# EAGLE design MouseMA (EAGLE 9.6.2)
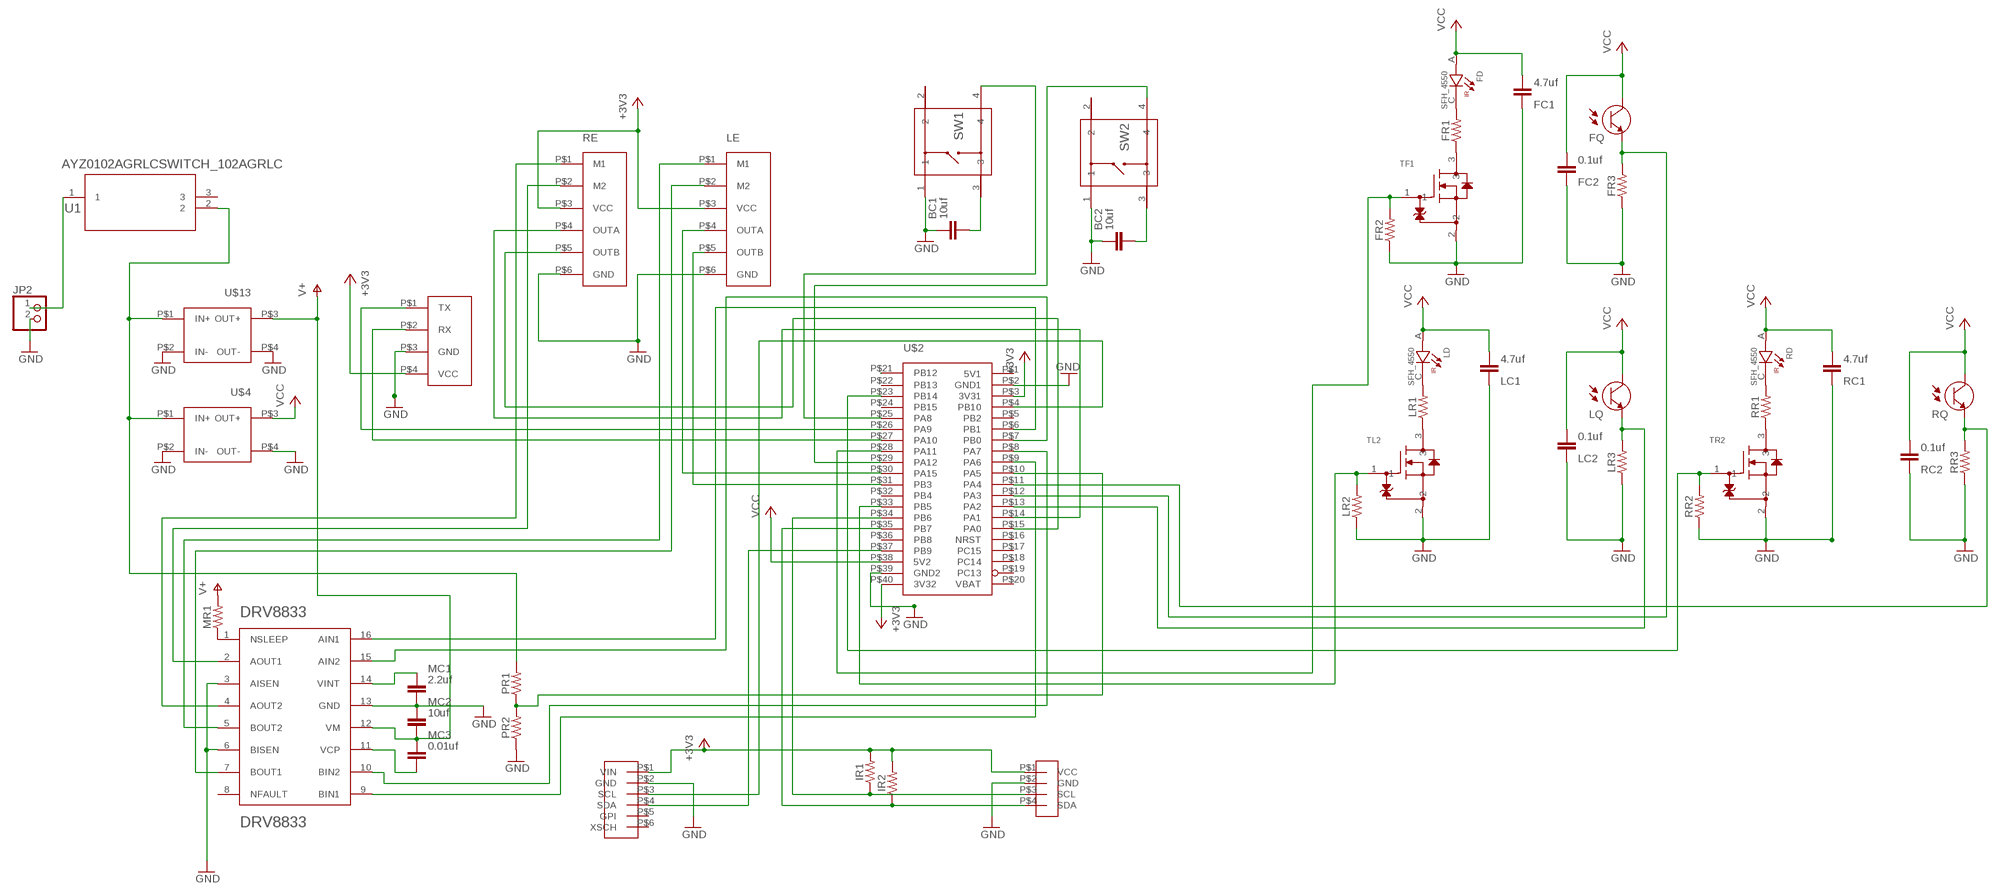
[diagram p0: schematic, sheet 1]

## Parts
BC1  10uf  CAPACITOR_NPOL-0805  [C805]
BC2  10uf  CAPACITOR_NPOL-0805  [C805]
DRV8833PWP1  DRV8833  [SOP65P640X120-17N]
FC1  4.7uf  CAPACITOR_NPOL-0805  [C805]
FC2  0.1uf  CAPACITOR_NPOL-0805  [C805]
FD  SFH_4550  [DIO_SFH_4550]
FQ  TEFT4300  [XDCR_TEFT4300]
FR1  RESISTOR0805  [0805]
FR2  RESISTOR0805  [0805]
FR3  RESISTOR0805  [0805]
IR1  2.0k  RESISTOR0805  [0805]
IR2  2.0k  RESISTOR0805  [0805]
JP2  PINHD-1X2  [1X02]
LC1  4.7uf  CAPACITOR_NPOL-0805  [C805]
LC2  0.1uf  CAPACITOR_NPOL-0805  [C805]
LD  SFH_4550  [DIO_SFH_4550]
LE  ENCODER  [6PINS]
LQ  TEFT4300  [XDCR_TEFT4300]
LR1  RESISTOR0805  [0805]
LR2  RESISTOR0805  [0805]
LR3  RESISTOR0805  [0805]
MC1  2.2uf  CAPACITOR_NPOL-0805  [C805]
MC2  10uf  CAPACITOR_NPOL-0805  [C805]
MC3  0.01uf  CAPACITOR_NPOL-0805  [C805]
MR1  RESISTOR0805  [0805]
PR1  18K  RESISTOR0805  [0805]
PR2  10k  RESISTOR0805  [0805]
RC1  4.7uf  CAPACITOR_NPOL-0805  [C805]
RC2  0.1uf  CAPACITOR_NPOL-0805  [C805]
RD  SFH_4550  [DIO_SFH_4550]
RE  ENCODER  [6PINS]
RQ  TEFT4300  [XDCR_TEFT4300]
RR1  RESISTOR0805  [0805]
RR2  RESISTOR0805  [0805]
RR3  RESISTOR0805  [0805]
SW1  PTS815_SJM_250_SMTR_LFSSW4_PTS815_SJM_250_SMTR_LFS_CN  [SW4_PTS815_SJM_250_SMTR_LFS_CN]
SW2  PTS815_SJM_250_SMTR_LFSSW4_PTS815_SJM_250_SMTR_LFS_CN  [SW4_PTS815_SJM_250_SMTR_LFS_CN]
TF1  SSM3K324R,LFSOT-23F_TOS  [SOT-23F_TOS]
TL2  SSM3K324R,LFSOT-23F_TOS  [SOT-23F_TOS]
TR2  SSM3K324R,LFSOT-23F_TOS  [SOT-23F_TOS]
U1  AYZ0102AGRLCSWITCH_102AGRLC  [SWITCH_102AGRLC]
U$1  LADAR6DEV  [6PINS]
U$2  STM32F4BOARD  [STM32BOARD]
U$3  OLEDVCC  [OLEPINS]
U$4  POWER1  [PWR1PINS]
U$13  POWER1  [PWR1PINS]
UARTXRX  UART2  [4PINS]

## Nets
+3V3: IR1.2 IR2.2 LE.P$3(VCC) RE.P$3(VCC) U$1.P$1(VIN) U$2.P$3(3V31) U$2.P$40(3V32) U$3.P$1(VCC) UARTXRX.P$4(VCC)
GND: BC1.1 BC2.1 DRV8833PWP1.3(AISEN) DRV8833PWP1.6(BISEN) DRV8833PWP1.13(GND) FC1.2 FC2.2 FR2.1 FR3.1 JP2.2 LC1.2 LC2.2 LE.P$6(GND) LR2.1 LR3.1 MC1.2 MC2.1 PR2.1 RC1.2 RC2.2 RE.P$6(GND) RR2.1 RR3.1 SW1.1 SW2.1 TF1.2 TL2.2 TR2.2 U$1.P$2(GND) U$2.P$2(GND1) U$2.P$39(GND2) U$3.P$2(GND) U$4.P$2(IN-) U$4.P$4(OUT-) U$13.P$2(IN-) U$13.P$4(OUT-) UARTXRX.P$3(GND)
N$1: LR2.2 TL2.1 U$2.P$33(PB5)
N$2: JP2.1 U1.1
N$3: BC2.2 SW2.3
N$4: PR1.1 PR2.2 U$2.P$10(PA5)
N$5: U$2.P$21(PB12)
N$6: U$2.P$26(PA9) UARTXRX.P$1(TX)
N$7: U$1.P$3(SCL) U$2.P$4(PB10)
N$8: DRV8833PWP1.10(BIN2) U$2.P$8(PA7)
N$9: U$1.P$4(SDA) U$2.P$37(PB9)
N$10: FR1.1 TF1.3
N$11: LR1.1 TL2.3
N$12: RR1.1 TR2.3
N$13: FR2.2 TF1.1 U$2.P$28(PA11)
N$14: IR2.1 U$2.P$35(PB7) U$3.P$4(SDA)
N$15: BC1.2 SW1.3
N$17: IR1.1 U$2.P$34(PB6) U$3.P$3(SCL)
N$18: RE.P$5(OUTB) U$2.P$15(PA0)
N$19: RE.P$4(OUTA) U$2.P$14(PA1)
N$21: FD.C FR1.2
N$22: DRV8833PWP1.2(AOUT1) RE.P$2(M2)
N$23: U$2.P$27(PA10) UARTXRX.P$2(RX)
N$24: DRV8833PWP1.4(AOUT2) RE.P$1(M1)
N$25: PR1.2 U1.2 U$4.P$1(IN+) U$13.P$1(IN+)
N$26: DRV8833PWP1.9(BIN1) U$2.P$9(PA6)
N$27: DRV8833PWP1.16(AIN1) U$2.P$6(PB1)
N$29: DRV8833PWP1.7(BOUT1) LE.P$2(M2)
N$30: DRV8833PWP1.5(BOUT2) LE.P$1(M1)
N$31: LE.P$5(OUTB) U$2.P$31(PB3)
N$32: LE.P$4(OUTA) U$2.P$30(PA15)
N$33: DRV8833PWP1.1(NSLEEP) MR1.1
N$34: SW2.4 U$2.P$29(PA12)
N$36: DRV8833PWP1.14(VINT) MC1.1
N$38: DRV8833PWP1.11(VCP) MC3.2
N$45: DRV8833PWP1.15(AIN2) U$2.P$7(PB0)
N$46: FQ.E FR3.2 U$2.P$12(PA3)
N$50: RQ.E RR3.2 U$2.P$11(PA4)
N$52: LQ.E LR3.2 U$2.P$13(PA2)
N$53: SW1.4 U$2.P$25(PA8)
N$54: LD.C LR1.2
N$62: RD.C RR1.2
N$63: RR2.2 TR2.1 U$2.P$23(PB14)
V+: DRV8833PWP1.12(VM) MC2.2 MC3.1 MR1.2 U$13.P$3(OUT+)
VCC: FC1.1 FC2.1 FD.A FQ.C LC1.1 LC2.1 LD.A LQ.C RC1.1 RC2.1 RD.A RQ.C U$2.P$38(5V2) U$4.P$3(OUT+)
Unconnected: DRV8833PWP1.8(NFAULT) SW1.2 SW2.2 U1.3 U$1.P$5(GPI) U$1.P$6(XSCH) U$2.P$5(PB2) U$2.P$16(NRST) U$2.P$17(PC15) U$2.P$18(PC14) U$2.P$19(PC13) U$2.P$22(PB13) U$2.P$24(PB15) U$2.P$32(PB4) U$2.P$36(PB8)

## Power pins joined to a net without a drawn wire
5V1: U$2.P$1(5V1)
VBAT: U$2.P$20(VBAT)

## Library data of the parts
BC1 BC2 FC1 FC2 LC1 LC2 MC1-MC3 RC1 RC2 = dp_devices:CAPACITOR_NPOL: Non-Polarized capacitor in various packages
DRV8833PWP1 = DRV8833PWP:DRV8833
FD LD RD = SFH_4550:SFH_4550: Infrared Emitter (850 nm) Check prices <https://pricing.snapeda.com/parts/SFH%204550/OSRAM%20Opto/view-part?ref=eda>
FQ LQ RQ = TEFT4300:TEFT4300; DESCRIPTION: Phototransistors 925nm Top View Radial, 3mm Dia (T-1); DIGI-KEY_PART_NUMBER: 751-1041-ND; MF: Vishay Semiconductor; MP: TEFT4300; PACKAGE: Radial Vishay; PURCHASE-URL: https://pricing.snapeda.com/search/part/TEFT4300/?ref=eda
FR1-FR3 IR1 IR2 LR1-LR3 MR1 PR1 PR2 RR1-RR3 = SparkFun-Resistors:RESISTOR: Generic Resistor Package
JP2 = pinhead:PINHD-1X2: PIN HEADER
LE RE = MouseLib:ENCODER
SW1 SW2 = 2024-03-03_00-07-10_Library:PTS815_SJM_250_SMTR_LFS; COPYRIGHT: Copyright (C) 2024 Ultra Librarian. All rights reserved.; MANUFACTURER_PART_NUMBER: PTS815 SJM 250 SMTR LFS; MFR_NAME: C&K Components
TF1 TL2 TR2 = 2024-11-24_22-53-16_Library:SSM3K324R,LF; COPYRIGHT: Copyright (C) 2024 Ultra Librarian. All rights reserved.; MANUFACTURER_PART_NUMBER: SSM3K324R,LF; MFR_NAME: Toshiba Electronic Devices & Storage Corp.
U1 = 2024-03-03_00-04-04_Library:AYZ0102AGRLC; COPYRIGHT: Copyright (C) 2024 Ultra Librarian. All rights reserved.; MANUFACTURER_PART_NUMBER: AYZ0102AGRLC; MFR_NAME: C&K Components
U$1 = MouseLib:LADAR6DEV
U$2 = MouseLib:STM32F4BOARD
U$3 = MouseLib:OLEDVCC
U$4 U$13 = MouseLib:POWER1
UARTXRX = MouseLib:UART2

## Board
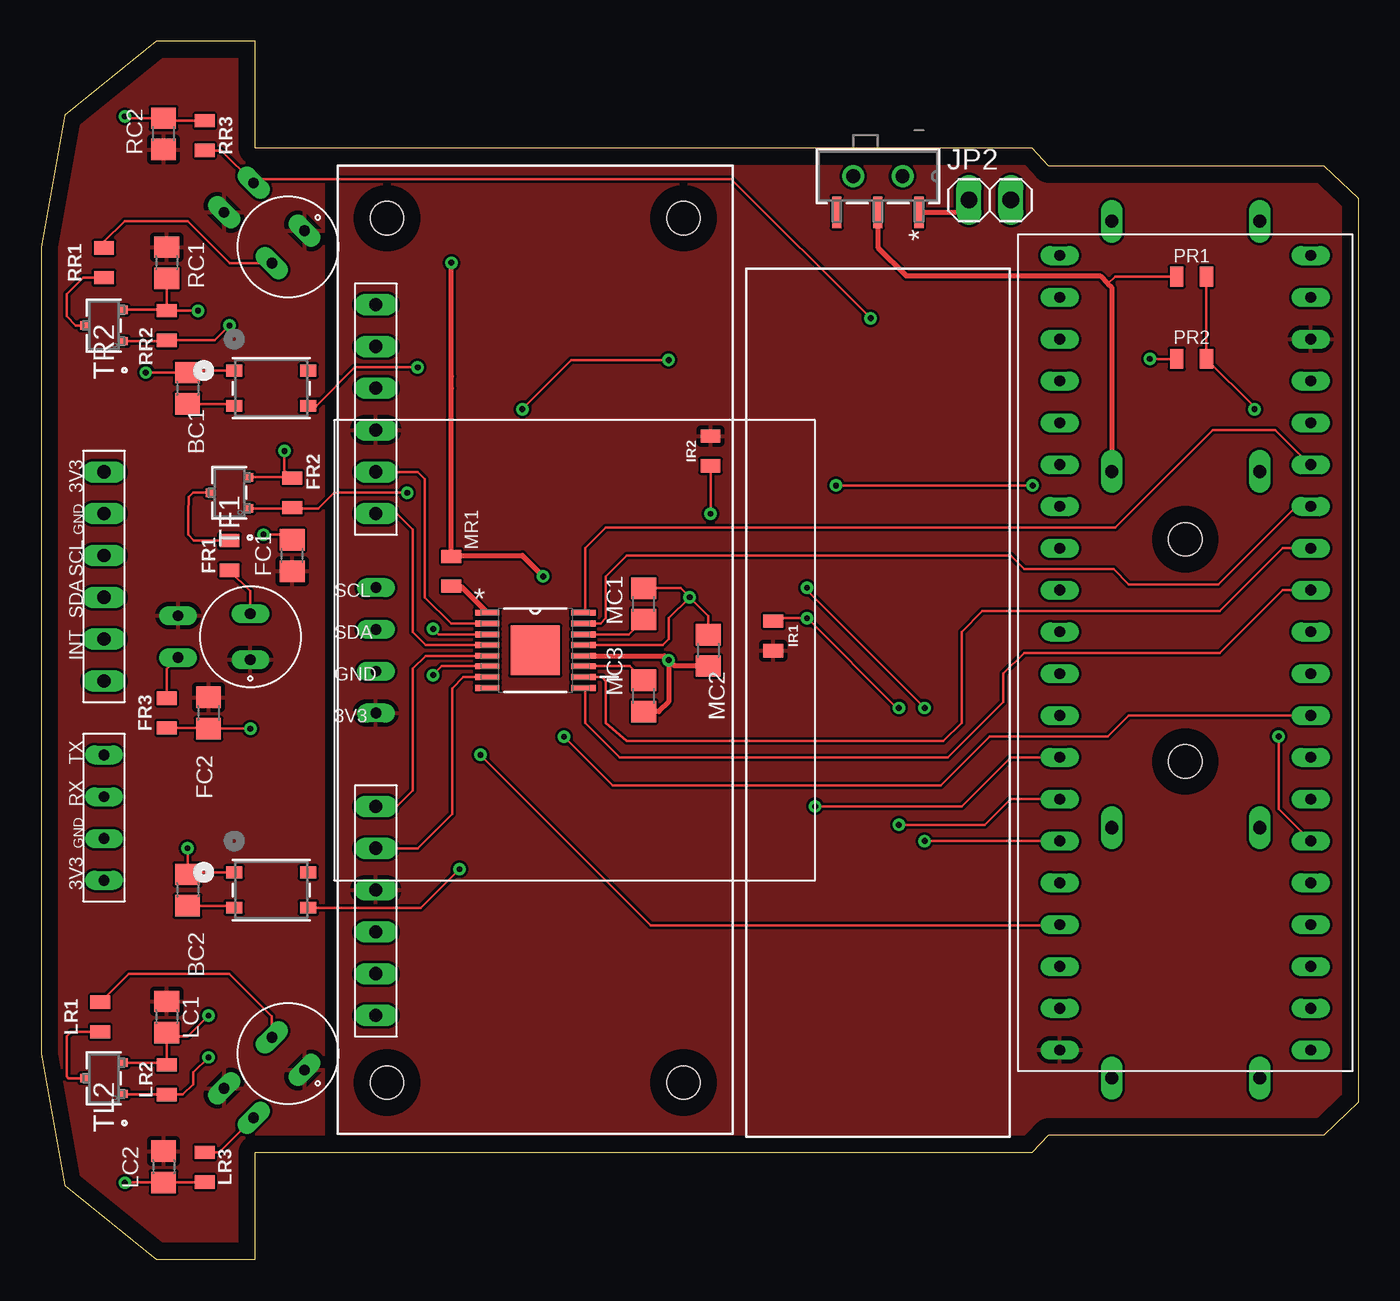
[diagram p1: board, top side]
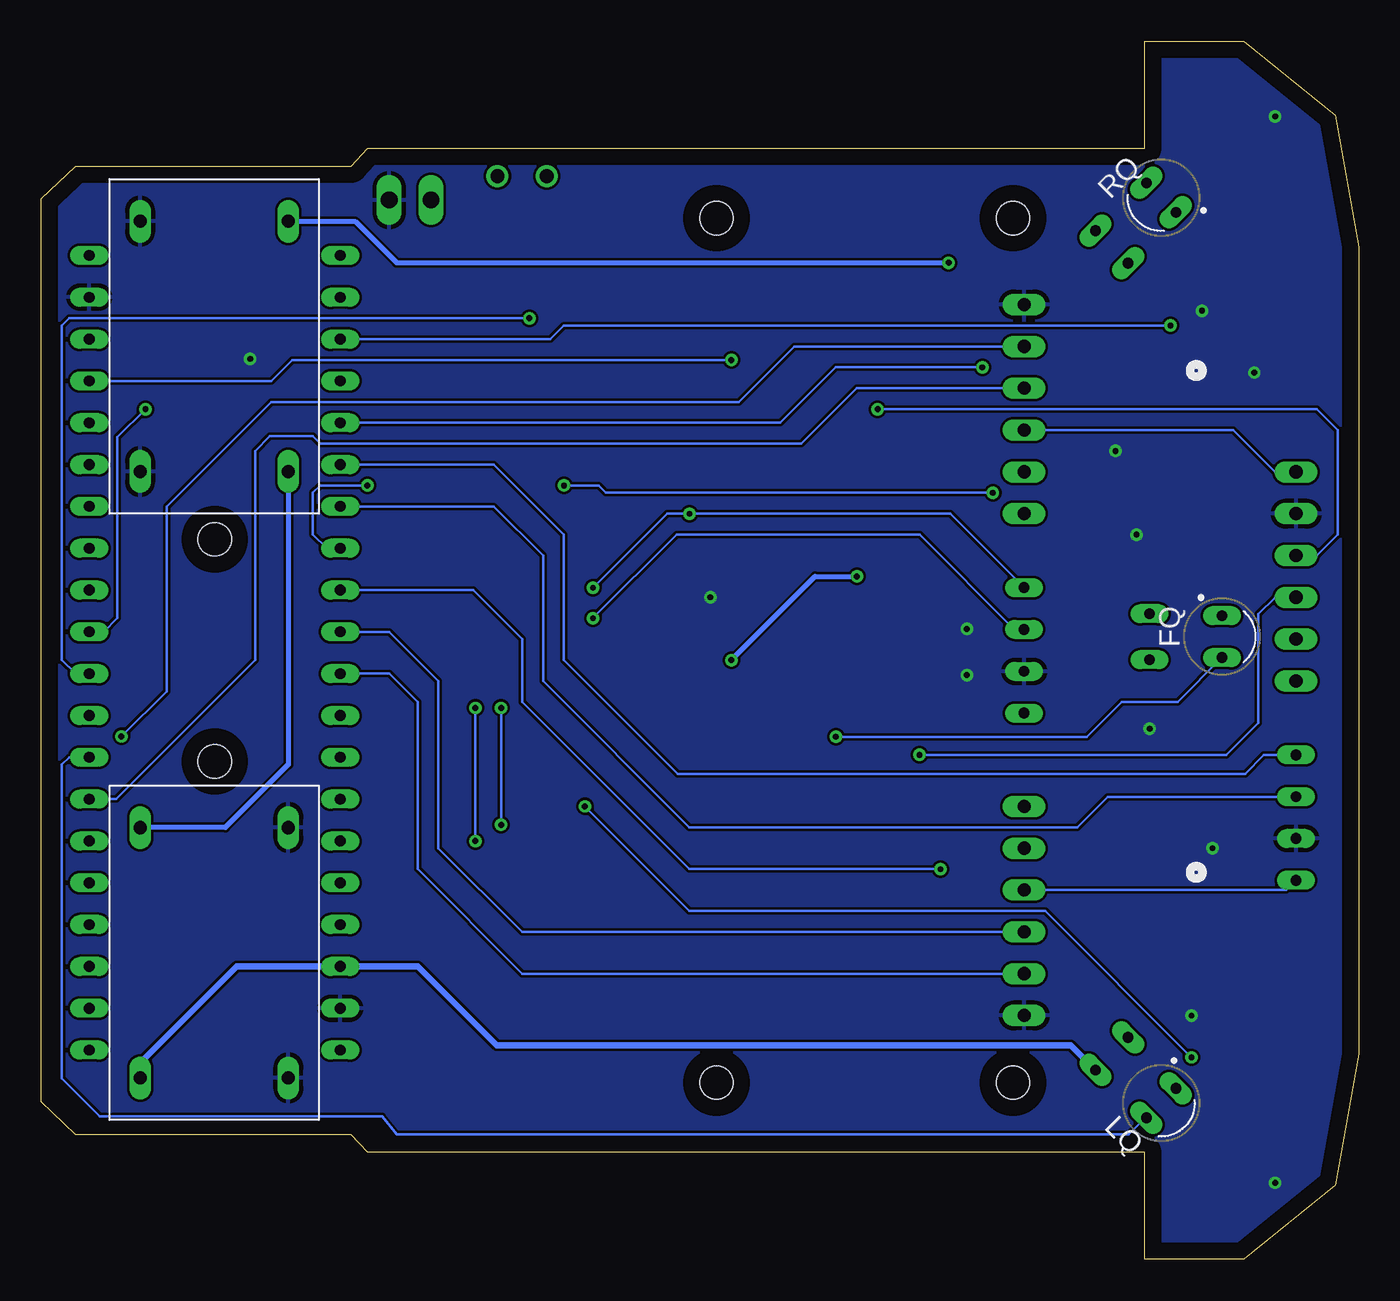
[diagram p2: board, bottom side, seen from below]

Size 80 x 74 mm. Coordinates in mm from the lower left corner, seen from the top.
Outline: 1.42,4.5 7,0 13,0 13,6.5 60.16,6.5 61.16,7.58 77.89,7.58 80,9.58 80,64.42 77.89,66.42 61.16,66.42 60.16,67.5 13,67.5 13,74 7,74 1.42,69.5 0,61.5 0,12.5 1.42,4.5
Copper layers (1*16): Top 0.035mm / dielectric 1.5mm / Bottom 0.035mm
Design rules "default": minimum track width 6mil, minimum drill 0.35mm, track to track 6mil, track to pad 6mil, pad to pad 6mil, via to via 6mil, smd to smd 6mil, copper to edge 40mil, drill to drill 6mil, minimum pad ring 10mil, minimum via ring 8mil, stop-mask expansion 4mil, vias tented up to drill 0mil, thermal gap 10mil
Holes 2 mm at 69.46,43.75 69.46,30.25 39,63.25 21,63.25 21,10.75 39,10.75

### Footprints (pad centres in the part's own frame; a part is rotated, then mirrored left to right if it is on the bottom)
C805 = smd 1.3 x 1.5: 1 -0.95,0; 2 0.95,0
SOP65P640X120-17N = smd 1.473 x 0.356: 1 -2.921,2.286; 2 -2.921,1.626; 3 -2.921,0.965; 4 -2.921,0.33; 5 -2.921,-0.33; 6 -2.921,-0.965; 7 -2.921,-1.626; 8 -2.921,-2.286; 9 2.921,-2.286; 10 2.921,-1.626; 11 2.921,-0.965; 12 2.921,-0.33; 13 2.921,0.33; 14 2.921,0.965; 15 2.921,1.626; 16 2.921,2.286 | smd 2.997 x 2.997: 17 0,0
DIO_SFH_4550 = drill 0.65 long: A 1.397,0; C -1.397,0
XDCR_TEFT4300 = drill 0.65 long: C 1.27,0; E -1.27,0
0805 = smd 0.8 x 1.2: 1 -0.9,0; 2 0.9,0
1X02 = drill 1.016 long: 1 -1.27,0; 2 1.27,0
6PINS = drill 0.8 pad 1.143 long: P$1 -2.54,10.16; P$2 -2.54,7.62; P$3 -2.54,5.08; P$4 -2.54,2.54; P$5 -2.54,0; P$6 -2.54,-2.54
SW4_PTS815_SJM_250_SMTR_LFS_CN = smd 0.991 x 0.711: 1 -2.25,1.075; 2 2.25,1.075; 3 -2.25,-1.075; 4 2.25,-1.075
SOT-23F_TOS = smd 0.508 x 0.508: 1 -0.95,-1.194; 2 0.95,-1.194; 3 0,1.194
SWITCH_102AGRLC = smd 1.905 x 0.559: 1 2.197,2.5; 2 2.197,0; 3 2.197,-2.5 | drill 0.838 pad 1.346: 4 0,-1.5; 5 0,1.5
STM32BOARD = drill 0.65 long: P$1 8.89,30.48; P$2 8.89,27.94; P$3 8.89,25.4; P$4 8.89,22.86; P$5 8.89,20.32; P$6 8.89,17.78; P$7 8.89,15.24; P$8 8.89,12.7; P$9 8.89,10.16; P$10 8.89,7.62; P$11 8.89,5.08; P$12 8.89,2.54; P$13 8.89,0; P$14 8.89,-2.54; P$15 8.89,-5.08; P$16 8.89,-7.62; P$17 8.89,-10.16; P$18 8.89,-12.7; P$19 8.89,-15.24; P$20 8.89,-17.78; P$21 -6.35,30.48; P$22 -6.35,27.94; P$23 -6.35,25.4; P$24 -6.35,22.86; P$25 -6.35,20.32; P$26 -6.35,17.78; P$27 -6.35,15.24; P$28 -6.35,12.7; P$29 -6.35,10.16; P$30 -6.35,7.62; P$31 -6.35,5.08; P$32 -6.35,2.54; P$33 -6.35,0; P$34 -6.35,-2.54; P$35 -6.35,-5.08; P$36 -6.35,-7.62; P$37 -6.35,-10.16; P$38 -6.35,-12.7; P$39 -6.35,-15.24; P$40 -6.35,-17.78
OLEPINS = drill 0.65 long: P$1 -3.81,12.7; P$2 -1.27,12.7; P$3 1.27,12.7; P$4 3.81,12.7
PWR1PINS = drill 0.8 pad 1.143 long: P$1 7.6,4.5; P$2 7.6,-4.5; P$3 -7.6,4.5; P$4 -7.6,-4.5
4PINS = drill 0.65 long: P$1 0,3.81; P$2 0,1.27; P$3 0,-1.27; P$4 0,-3.81

### Placement (x,y rotation side)
BC1  8.89,52.92 270 top
BC2  8.89,22.44 270 top
DRV8833PWP1  30,37 0 top
FC1  15.24,42.76 90 top
FC2  10.16,33.19 270 top
FD  12.7,37.83 270 top
FQ  8.31,37.83 90 bottom
FR1  11.43,42.76 270 top
FR2  15.24,46.57 270 top
FR3  7.62,33.19 90 top
IR1  44.45,37.88 270 top
IR2  40.64,49.11 90 top
JP2  57.6,64.35 0 top
LC1  7.62,14.73 270 top
LC2  7.43,5.63 270 top
LD  15,12.5 315 top
LE  22.86,17.36 0 top
LQ  12,9.5 45 bottom
LR1  3.59,14.73 90 top
LR2  7.62,10.92 270 top
LR3  9.93,5.61 90 top
MC1  36.58,39.82 90 top
MC2  40.5,37 270 top
MC3  36.58,34.23 90 top
MR1  24.9,41.8 90 top
PR1  69.85,59.7 180 top
PR2  69.85,54.7 0 top
RC1  7.62,60.54 270 top
RC2  7.43,68.37 90 top
RD  15,61.5 45 top
RE  17.78,55.46 180 top
RQ  12,64.5 315 bottom
RR1  3.81,60.54 90 top
RR2  7.62,56.73 270 top
RR3  9.93,68.26 270 top
SW1  13.97,52.92 0 top
SW2  13.97,22.44 0 top
TF1  11.43,46.57 90 top
TL2  3.81,11.01 90 top
TR2  3.81,56.73 90 top
U1  50.8,65.8 270 top
U$1  6.35,37.68 0 top
U$2  68.19,30.5 0 top
U$3  33.02,37 90 top
U$4  69.49,18.63 90 bottom
U$13  69.49,55.46 270 bottom
UARTXRX  3.81,26.84 0 top

### Tracks (layer width: path | path; a pad name or v marks a point on that pad's centre or on a via)
+3V3
  Bottom 0.152: U$1.P$1 5.08,47.84 7.62,50.38 RE.P$3 | UARTXRX.P$4 4.4,22.44 LE.P$3
  pour Top: 18.2,73.24 18.2,0.85 86.36,0.85 86.36,73.24
GND  (via drill 0.35)
  Top 0.152: RR2.1 RC1.2 | v5.08,69.43 5.19,69.32 RC2.2 7.59,69.16 RR3.1 | v6.35,53.87 BC1.1 9.02,53.99 SW1.1 | FR3.1 10.11,32.29 FC2.2 v12.7,32.24 | v8.89,24.98 BC2.1 9.02,23.52 SW2.1 | LR3.1 9.9,4.68 LC2.2 5.1,4.68 v5.08,4.66 | v67.31,54.7 PR2.1 | MC1.2 38.82,40.77 v39.37,40.22 | v10.16,14.82 8.89,13.55 7.85,13.55 LC1.2 LR2.1 7.37,11.57 6.98,11.96 TL2.2 | DRV8833PWP1.13 37.75,37.33 38.1,37.68 38.1,38.95 v39.37,40.22 | DRV8833PWP1.3 24.14,37.97 v23.8,38.3 | v23.8,35.5 24.34,36.03 DRV8833PWP1.6 | v39.37,40.22 40.5,39.09 MC2.1 | FC1.2 14.92,44.03 v13.5,44.03 | TR2.2 7.57,57.68 RR2.1 | TF1.2 15.19,47.52 FR2.1 14.77,47.94 v14.77,49.11 | RR2.1 v9.53,57.63
  pour Bottom: -7.62,68.16 -7.62,0.85 3.81,-10.58 88.9,-10.58 88.9,82.13 6.35,82.13
N$1  (via drill 0.35)
  Top 0.152: TL2.1 5.04,10.02 LR2.2 8.61,10.02 9.24,10.66 9.24,11.36 v10.16,12.28 | v46.99,27.52 55.88,27.52 58.86,30.5 U$2.P$33
  Bottom 0.152: v10.16,12.28 19.05,21.17 40.64,21.17 v46.99,27.52
N$2
  Top 0.305: U1.1 56.4,63.6 JP2.1
N$3
  Top 0.152: BC2.2 11.6,21.49 SW2.3
N$4  (via drill 0.35)
  Top 0.152: v73.66,51.65 73.66,51.79 PR2.2 PR1.1
  Bottom 0.152: v73.66,51.65 75.37,49.94 75.37,38.95 76.2,38.12 U$2.P$10
N$6
  Bottom 0.152: UARTXRX.P$1 5.76,30.65 6.91,29.5 41.35,29.5 48.26,36.41 48.26,44.03 52.51,48.28 60.13,48.28 60.96,48.28 U$2.P$26
N$7  (via drill 0.35)
  Top 0.152: v29.21,51.65 32.19,54.63 v38.1,54.63
  Bottom 0.152: U$2.P$4 66.04,53.36 64.77,54.63 v38.1,54.63 | U$1.P$3 2.54,42.76 1.27,44.03 1.27,50.38 2.54,51.65 v29.21,51.65
N$8
  Top 0.152: DRV8833PWP1.10 34.06,35.37 34.29,35.14 34.29,32.6 35.56,31.5 54.78,31.5 55.88,32.6 55.88,38.12 57.15,39.39 71.56,39.39 75.37,43.2 U$2.P$8
N$9  (via drill 0.35)
  Top 0.152: v26.67,30.65 37.02,20.3 61.88,20.3 U$2.P$37
  Bottom 0.152: v26.67,30.65 8.89,30.65 8.3,30.65 8.05,30.65 6.1,32.6 6.1,39.2 5.08,40.22 U$1.P$4
N$10
  Top 0.152: FR1.1 9.26,43.66 8.94,44.03 8.94,45.3 8.97,46.3 9.24,46.57 TF1.3
N$11
  Top 0.152: TL2.3 1.66,11.01 1.54,11.13 1.54,13.55 1.82,13.83 LR1.1
N$12
  Top 0.152: RR1.1 2.54,59.64 1.54,58.64 1.54,57.3 2.11,56.73 2.54,56.73 TR2.3
N$13  (via drill 0.35)
  Top 0.152: TF1.1 15.29,45.62 | FR2.2 15.29,45.62 | 15.29,45.62 16.83,45.62 17.78,46.57 v22.23,46.57 | v48.26,47.01 v60.2,47.01
  Bottom 0.152: v22.23,46.57 45.72,46.57 46.16,47.01 v48.26,47.01 | v60.2,47.01 63.06,47.01 63.5,46.57 63.5,44.03 62.67,43.2 U$2.P$28
N$14  (via drill 0.35)
  Top 0.152: IR2.1 v40.64,45.3 | v53.64,25.42 U$2.P$35 | v53.64,33.5 46.5,40.64 v46.5,40.8
  Bottom 0.152: U$3.P$4 24.81,45.3 v40.64,45.3 41.91,45.3 42,45.3 v46.5,40.8 | v53.64,33.5 v53.64,25.42
N$15
  Top 0.152: BC1.2 11.6,51.97 SW1.3
N$17  (via drill 0.35)
  Top 0.152: U$2.P$34 58.86,27.96 57.3,26.4 v52.07,26.4 | IR1.1 44.62,38.95 v46.5,38.95 51.95,33.5 v52.07,33.5
  Bottom 0.152: U$3.P$3 20.91,38.27 26.67,44.03 41.42,44.03 v46.5,38.95 | v52.07,33.5 v52.07,26.4
N$18  (via drill 0.35)
  Top 0.152: U$2.P$15 75.13,27.37 v75.13,31.77
  Bottom 0.152: RE.P$5 34.29,55.46 37.66,52.09 66.04,52.09 72.39,45.74 72.39,34.51 v75.13,31.77
N$19
  Bottom 0.152: RE.P$4 30.48,52.92 33.85,49.55 63.05,49.55 63.5,50 66.11,50 67,49.11 67,36.41 75.45,27.96 75.76,27.96 76.2,27.96 U$2.P$14
N$21
  Top 0.152: FR1.2 12.7,40.59 FD.C
N$22
  Top 0.152: DRV8833PWP1.2 24.89,38.63 23.3,40.22 23.3,47.4 22.86,47.84 RE.P$2
N$23
  Bottom 0.152: UARTXRX.P$2 15.24,28.11 17.1,26.25 40.64,26.25 49.53,35.14 49.53,42.76 52.51,45.74 U$2.P$27
N$24
  Top 0.152: RE.P$1 21.59,45.3 22.55,44.34 22.55,38.12 23.34,37.33 DRV8833PWP1.4
N$25
  Top 0.152: PR1.2 65.2,59.7 64.77,59.27
  Top 0.305: U$13.P$1 64.99,59.05 64.77,59.27 64.29,59.75 52.51,59.75 50.8,61.46 U1.2
  Bottom 0.305: U$13.P$1 64.99,30.06 68.82,26.23 U$4.P$1
N$26
  Top 0.152: DRV8833PWP1.9 33.02,34.62 33.02,32.6 35.12,30.5 55.05,30.5 58.42,33.87 58.42,35.58 59.69,36.85 71.56,36.85 75.37,40.66 U$2.P$9
N$27
  Top 0.152: DRV8833PWP1.16 33.02,39.38 33.02,43.2 34.29,44.47 65.21,44.47 71.12,50.38 74.93,50.38 77.03,48.28 U$2.P$6
N$29
  Top 0.152: DRV8833PWP1.7 25.63,35.37 24.95,34.69 24.95,27.07 22.86,24.98 LE.P$2
N$30
  Top 0.152: DRV8833PWP1.5 23.34,36.67 22.55,35.88 22.55,28.48 21.59,27.52 LE.P$1
N$31
  Bottom 0.152: LE.P$5 50.8,17.36 57.15,23.71 57.15,33.87 58.86,35.58 U$2.P$31
N$32
  Bottom 0.152: LE.P$4 50.8,19.9 55.88,24.98 55.88,35.14 58.86,38.12 U$2.P$30
N$33
  Top 0.305: MR1.1 25.46,40.9 DRV8833PWP1.1
N$34  (via drill 0.35)
  Top 0.152: SW2.4 23.05,21.36 v25.4,23.71
  Bottom 0.152: U$2.P$29 58.42,40.66 57.59,40.66 53.78,40.66 50.8,37.68 50.8,33.87 40.64,23.71 v25.4,23.71
N$36
  Top 0.152: DRV8833PWP1.14 35.67,37.97 MC1.1
N$38
  Top 0.152: DRV8833PWP1.11 35.73,36.03 MC3.2
N$45
  Top 0.152: DRV8833PWP1.15 33.97,38.63 34.29,38.95 34.29,41.49 35.56,42.76 58.86,42.76 59.69,41.93 65.11,41.93 66.04,41 71.46,41 76.2,45.74 U$2.P$7
N$46  (via drill 0.35)
  Top 0.152: FR3.2 7.62,35.87 FQ.E | v31.75,31.75 34.71,28.79 54.61,28.79 57.59,31.77 64.77,31.77 66.04,33.04 66.87,33.04 67.31,33.04 U$2.P$12
  Bottom 0.152: FQ.E 11,33.87 14.39,33.87 16.51,31.75 v31.75,31.75
N$50  (via drill 0.35)
  Top 0.152: v50.36,57.17 41.91,65.62 13.12,65.62 RQ.E 10.94,67.36 RR3.2
  Bottom 0.152: U$2.P$11 77.91,35.58 78.74,36.41 78.74,56.73 78.3,57.17 v50.36,57.17
N$52
  Top 0.152: LR3.2 10.81,6.51 LQ.E
  Bottom 0.152: LQ.E 12.96,8.6 13.97,7.59 58.41,7.59 59.29,8.7 76.43,8.7 78.74,11.01 78.74,30.06 78.3,30.5 U$2.P$13
N$53  (via drill 0.35)
  Top 0.152: SW1.4 16.7,51.84 19.05,54.19 v22.86,54.19
  Bottom 0.152: U$2.P$25 35.12,50.82 31.75,54.19 v22.86,54.19
N$54
  Top 0.152: LR1.2 5.32,17.36 11.43,17.36 14.01,14.78 LD.C
N$62
  Top 0.152: RR1.2 3.81,61.81 5.08,63.08 8.89,63.08 11.46,60.51 RD.C
N$63  (via drill 0.35)
  Top 0.152: TR2.1 7.57,55.78 RR2.2 10.53,55.83 v11.43,56.73
  Bottom 0.152: v11.43,56.73 48.26,56.73 49.09,55.9 U$2.P$23
V+  (via drill 0.35)
  Top 0.305: MC2.2 38.46,36.05 v38.1,36.41 | v38.1,36.41 38.1,33.87 37.51,33.28 MC3.1 | DRV8833PWP1.12 37.84,36.67 v38.1,36.41 | v30.48,41.49 29.21,42.76 24.96,42.76 MR1.2 24.9,52.92 24.9,53.64 v24.9,60.54
  Bottom 0.305: v38.1,36.41 33.02,41.49 v30.48,41.49 | U$13.P$3 60.94,63.06 58.42,60.54 v24.9,60.54
VCC
  Bottom 0.406: LD.A 17.48,13 52.35,13 57.15,17.8 U$2.P$38 68.14,17.8 73.99,11.95 U$4.P$3
  pour Top: -1.27,71.97 -1.27,2.12 2.54,-1.69 15.24,-1.69 17.14,-0.42 17.14,73.24 16.51,74.51 13.97,77.05 3.81,77.05

### Text on the board
tPlace: 3V3 | GND | SCL | SCL | SDA | SDA | INT | GND | 3V3 | TX | RX | GND | 3V3